# Altium schematic sheet microcontroller.SchDoc
size A3
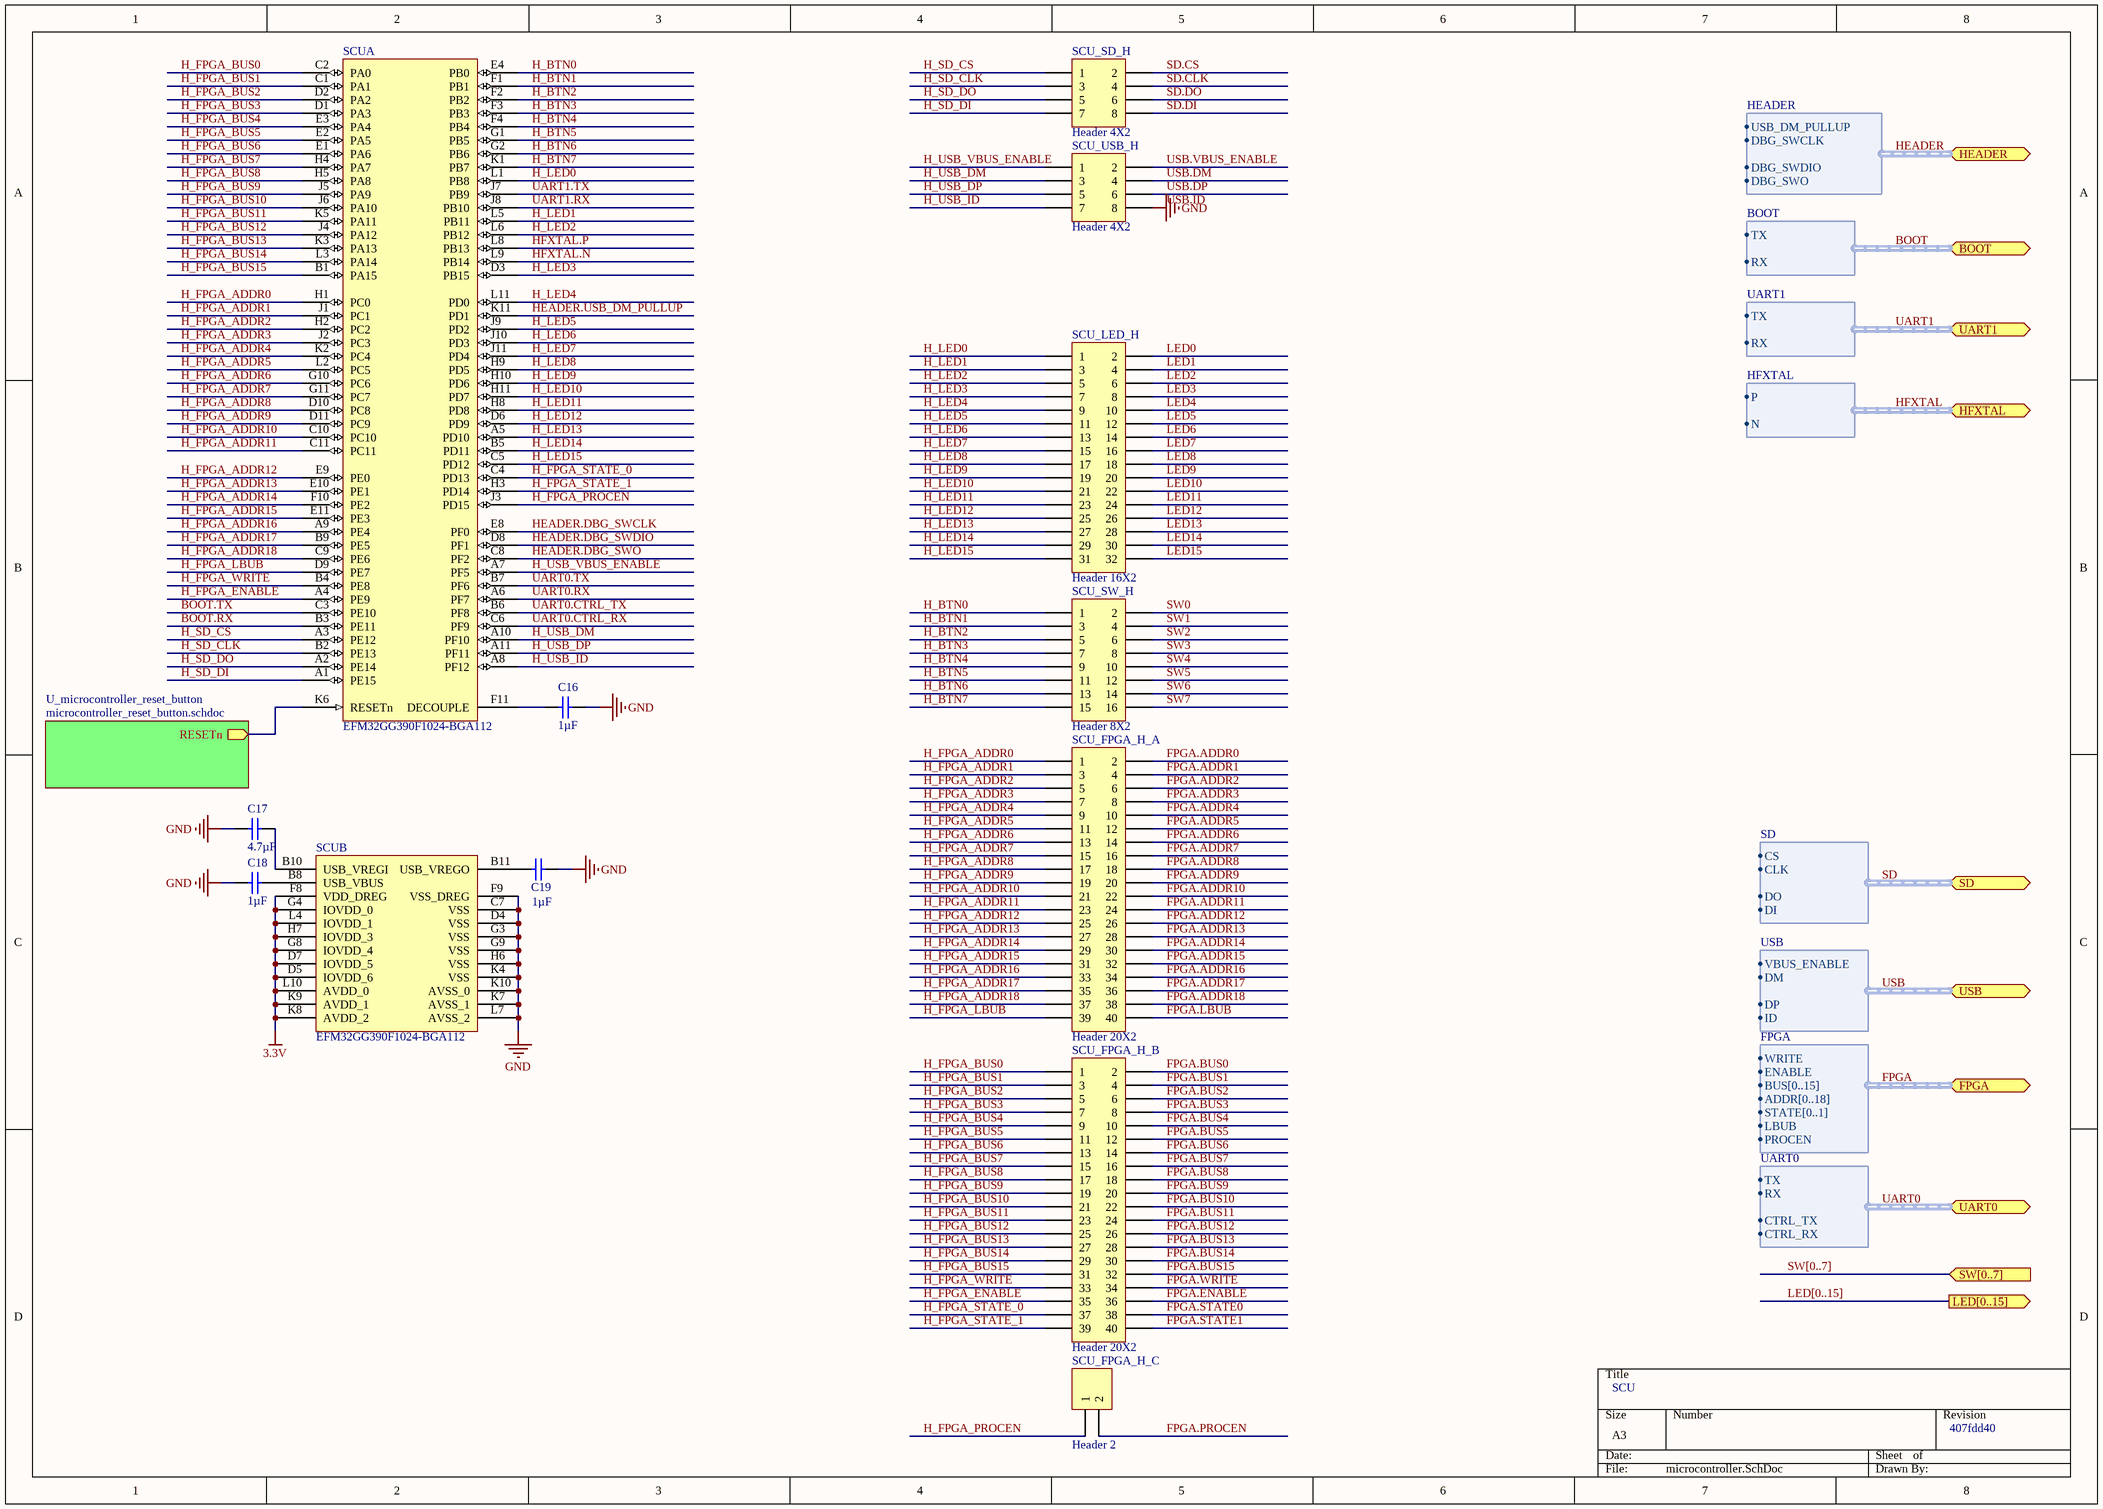
[diagram p0: microcontroller.SchDoc]

## Parts
C16  value 1µF  [CAPC1210(3225)100_L]  (hidden comment: CAP 1uF 100V 1210(3225))
C17  value 4.7µF  [CAPC1210(3225)100_L]  (hidden comment: CAP 4.7uF 100V 1210(3225))
C18  value 1µF  [CAPC1210(3225)100_L]  (hidden comment: CAP 1uF 100V 1210(3225))
C19  value 1µF  [CAPC1210(3225)100_L]  (hidden comment: CAP 1uF 100V 1210(3225))
SCU  EFM32GG390F1024-BGA112  [ENMR-BGA112]  (parts A,B of 2)
SCU_FPGA_H_A  Header 20X2  [HDR2X20]
SCU_FPGA_H_B  Header 20X2  [HDR2X20]
SCU_FPGA_H_C  Header 2  [HDR1X2]
SCU_LED_H  Header 16X2  [HDR2X16]
SCU_SD_H  Header 4X2  [HDR2X4]
SCU_SW_H  Header 8X2  [HDR2X8]
SCU_USB_H  Header 4X2  [HDR2X4]

## Sub-sheets
U_microcontroller_reset_button = microcontroller_reset_button.schdoc: RESETn (out)

## Ports
BOOT (harness BOOT), FPGA (harness FPGA), HEADER (harness HEADER), HFXTAL (harness HFXTAL), LED[0..15] (out), SD (harness SD), SW[0..7] (in), UART0 (harness UART0), UART1 (harness UART1), USB (harness USB)

## Harnesses
UART0: TX, RX, CTRL_TX, CTRL_RX
FPGA: WRITE, ENABLE, ADDR[0..18], STATE[0..1], BUS[0..15], LBUB, PROCEN
HFXTAL: P, N
UART1: TX, RX
USB: VBUS_ENABLE, DM, DP, ID
BOOT: TX, RX
SD: CS, CLK, DO, DI
HEADER: USB_DM_PULLUP, DBG_SWCLK, DBG_SWDIO, DBG_SWO

## Nets
3.3V: SCU.D5(IOVDD_6) SCU.D7(IOVDD_5) SCU.F8(VDD_DREG) SCU.G4(IOVDD_0) SCU.G8(IOVDD_4) SCU.H7(IOVDD_3) SCU.K8(AVDD_2) SCU.K9(AVDD_1) SCU.L4(IOVDD_1) SCU.L10(AVDD_0)
GND: C16.2 C17.2 C18.2 C19.2 SCU.C7(VSS) SCU.D4(VSS) SCU.F9(VSS_DREG) SCU.G3(VSS) SCU.G9(VSS) SCU.H6(VSS) SCU.K4(VSS) SCU.K7(AVSS_1) SCU.K10(AVSS_0) SCU.L7(AVSS_2) SCU_USB_H.8
BOOT.RX: SCU.B3(PE11)
BOOT.TX: SCU.C3(PE10)
FPGA.ADDR0: SCU_FPGA_H_A.2
FPGA.ADDR1: SCU_FPGA_H_A.4
FPGA.ADDR2: SCU_FPGA_H_A.6
FPGA.ADDR3: SCU_FPGA_H_A.8
FPGA.ADDR4: SCU_FPGA_H_A.10
FPGA.ADDR5: SCU_FPGA_H_A.12
FPGA.ADDR6: SCU_FPGA_H_A.14
FPGA.ADDR7: SCU_FPGA_H_A.16
FPGA.ADDR8: SCU_FPGA_H_A.18
FPGA.ADDR9: SCU_FPGA_H_A.20
FPGA.ADDR10: SCU_FPGA_H_A.22
FPGA.ADDR11: SCU_FPGA_H_A.24
FPGA.ADDR12: SCU_FPGA_H_A.26
FPGA.ADDR13: SCU_FPGA_H_A.28
FPGA.ADDR14: SCU_FPGA_H_A.30
FPGA.ADDR15: SCU_FPGA_H_A.32
FPGA.ADDR16: SCU_FPGA_H_A.34
FPGA.ADDR17: SCU_FPGA_H_A.36
FPGA.ADDR18: SCU_FPGA_H_A.38
FPGA.BUS0: SCU_FPGA_H_B.2
FPGA.BUS1: SCU_FPGA_H_B.4
FPGA.BUS2: SCU_FPGA_H_B.6
FPGA.BUS3: SCU_FPGA_H_B.8
FPGA.BUS4: SCU_FPGA_H_B.10
FPGA.BUS5: SCU_FPGA_H_B.12
FPGA.BUS6: SCU_FPGA_H_B.14
FPGA.BUS7: SCU_FPGA_H_B.16
FPGA.BUS8: SCU_FPGA_H_B.18
FPGA.BUS9: SCU_FPGA_H_B.20
FPGA.BUS10: SCU_FPGA_H_B.22
FPGA.BUS11: SCU_FPGA_H_B.24
FPGA.BUS12: SCU_FPGA_H_B.26
FPGA.BUS13: SCU_FPGA_H_B.28
FPGA.BUS14: SCU_FPGA_H_B.30
FPGA.BUS15: SCU_FPGA_H_B.32
FPGA.ENABLE: SCU_FPGA_H_B.36
FPGA.LBUB: SCU_FPGA_H_A.40
FPGA.PROCEN: SCU_FPGA_H_C.2
FPGA.STATE0: SCU_FPGA_H_B.38
FPGA.STATE1: SCU_FPGA_H_B.40
FPGA.WRITE: SCU_FPGA_H_B.34
H_BTN0: SCU.E4(PB0) SCU_SW_H.1
H_BTN1: SCU.F1(PB1) SCU_SW_H.3
H_BTN2: SCU.F2(PB2) SCU_SW_H.5
H_BTN3: SCU.F3(PB3) SCU_SW_H.7
H_BTN4: SCU.F4(PB4) SCU_SW_H.9
H_BTN5: SCU.G1(PB5) SCU_SW_H.11
H_BTN6: SCU.G2(PB6) SCU_SW_H.13
H_BTN7: SCU.K1(PB7) SCU_SW_H.15
H_FPGA_ADDR0: SCU.H1(PC0) SCU_FPGA_H_A.1
H_FPGA_ADDR1: SCU.J1(PC1) SCU_FPGA_H_A.3
H_FPGA_ADDR2: SCU.H2(PC2) SCU_FPGA_H_A.5
H_FPGA_ADDR3: SCU.J2(PC3) SCU_FPGA_H_A.7
H_FPGA_ADDR4: SCU.K2(PC4) SCU_FPGA_H_A.9
H_FPGA_ADDR5: SCU.L2(PC5) SCU_FPGA_H_A.11
H_FPGA_ADDR6: SCU.G10(PC6) SCU_FPGA_H_A.13
H_FPGA_ADDR7: SCU.G11(PC7) SCU_FPGA_H_A.15
H_FPGA_ADDR8: SCU.D10(PC8) SCU_FPGA_H_A.17
H_FPGA_ADDR9: SCU.D11(PC9) SCU_FPGA_H_A.19
H_FPGA_ADDR10: SCU.C10(PC10) SCU_FPGA_H_A.21
H_FPGA_ADDR11: SCU.C11(PC11) SCU_FPGA_H_A.23
H_FPGA_ADDR12: SCU.E9(PE0) SCU_FPGA_H_A.25
H_FPGA_ADDR13: SCU.E10(PE1) SCU_FPGA_H_A.27
H_FPGA_ADDR14: SCU.F10(PE2) SCU_FPGA_H_A.29
H_FPGA_ADDR15: SCU.E11(PE3) SCU_FPGA_H_A.31
H_FPGA_ADDR16: SCU.A9(PE4) SCU_FPGA_H_A.33
H_FPGA_ADDR17: SCU.B9(PE5) SCU_FPGA_H_A.35
H_FPGA_ADDR18: SCU.C9(PE6) SCU_FPGA_H_A.37
H_FPGA_BUS0: SCU.C2(PA0) SCU_FPGA_H_B.1
H_FPGA_BUS1: SCU.C1(PA1) SCU_FPGA_H_B.3
H_FPGA_BUS2: SCU.D2(PA2) SCU_FPGA_H_B.5
H_FPGA_BUS3: SCU.D1(PA3) SCU_FPGA_H_B.7
H_FPGA_BUS4: SCU.E3(PA4) SCU_FPGA_H_B.9
H_FPGA_BUS5: SCU.E2(PA5) SCU_FPGA_H_B.11
H_FPGA_BUS6: SCU.E1(PA6) SCU_FPGA_H_B.13
H_FPGA_BUS7: SCU.H4(PA7) SCU_FPGA_H_B.15
H_FPGA_BUS8: SCU.H5(PA8) SCU_FPGA_H_B.17
H_FPGA_BUS9: SCU.J5(PA9) SCU_FPGA_H_B.19
H_FPGA_BUS10: SCU.J6(PA10) SCU_FPGA_H_B.21
H_FPGA_BUS11: SCU.K5(PA11) SCU_FPGA_H_B.23
H_FPGA_BUS12: SCU.J4(PA12) SCU_FPGA_H_B.25
H_FPGA_BUS13: SCU.K3(PA13) SCU_FPGA_H_B.27
H_FPGA_BUS14: SCU.L3(PA14) SCU_FPGA_H_B.29
H_FPGA_BUS15: SCU.B1(PA15) SCU_FPGA_H_B.31
H_FPGA_ENABLE: SCU.A4(PE9) SCU_FPGA_H_B.35
H_FPGA_LBUB: SCU.D9(PE7) SCU_FPGA_H_A.39
H_FPGA_PROCEN: SCU.J3(PD15) SCU_FPGA_H_C.1
H_FPGA_STATE_0: SCU.C4(PD13) SCU_FPGA_H_B.37
H_FPGA_STATE_1: SCU.H3(PD14) SCU_FPGA_H_B.39
H_FPGA_WRITE: SCU.B4(PE8) SCU_FPGA_H_B.33
H_LED0: SCU.L1(PB8) SCU_LED_H.1
H_LED1: SCU.L5(PB11) SCU_LED_H.3
H_LED2: SCU.L6(PB12) SCU_LED_H.5
H_LED3: SCU.D3(PB15) SCU_LED_H.7
H_LED4: SCU.L11(PD0) SCU_LED_H.9
H_LED5: SCU.J9(PD2) SCU_LED_H.11
H_LED6: SCU.J10(PD3) SCU_LED_H.13
H_LED7: SCU.J11(PD4) SCU_LED_H.15
H_LED8: SCU.H9(PD5) SCU_LED_H.17
H_LED9: SCU.H10(PD6) SCU_LED_H.19
H_LED10: SCU.H11(PD7) SCU_LED_H.21
H_LED11: SCU.H8(PD8) SCU_LED_H.23
H_LED12: SCU.D6(PD9) SCU_LED_H.25
H_LED13: SCU.A5(PD10) SCU_LED_H.27
H_LED14: SCU.B5(PD11) SCU_LED_H.29
H_LED15: SCU.C5(PD12) SCU_LED_H.31
H_SD_CLK: SCU.B2(PE13) SCU_SD_H.3
H_SD_CS: SCU.A3(PE12) SCU_SD_H.1
H_SD_DI: SCU.A1(PE15) SCU_SD_H.7
H_SD_DO: SCU.A2(PE14) SCU_SD_H.5
H_USB_DM: SCU.A10(PF10) SCU_USB_H.3
H_USB_DP: SCU.A11(PF11) SCU_USB_H.5
H_USB_ID: SCU.A8(PF12) SCU_USB_H.7
H_USB_VBUS_ENABLE: SCU.A7(PF5) SCU_USB_H.1
HEADER.DBG_SWCLK: SCU.E8(PF0)
HEADER.DBG_SWDIO: SCU.D8(PF1)
HEADER.DBG_SWO: SCU.C8(PF2)
HEADER.USB_DM_PULLUP: SCU.K11(PD1)
HFXTAL.N: SCU.L9(PB14)
HFXTAL.P: SCU.L8(PB13)
LED0: SCU_LED_H.2
LED1: SCU_LED_H.4
LED2: SCU_LED_H.6
LED3: SCU_LED_H.8
LED4: SCU_LED_H.10
LED5: SCU_LED_H.12
LED6: SCU_LED_H.14
LED7: SCU_LED_H.16
LED8: SCU_LED_H.18
LED9: SCU_LED_H.20
LED10: SCU_LED_H.22
LED11: SCU_LED_H.24
LED12: SCU_LED_H.26
LED13: SCU_LED_H.28
LED14: SCU_LED_H.30
LED15: SCU_LED_H.32
SD.CLK: SCU_SD_H.4
SD.CS: SCU_SD_H.2
SD.DI: SCU_SD_H.8
SD.DO: SCU_SD_H.6
SW0: SCU_SW_H.2
SW1: SCU_SW_H.4
SW2: SCU_SW_H.6
SW3: SCU_SW_H.8
SW4: SCU_SW_H.10
SW5: SCU_SW_H.12
SW6: SCU_SW_H.14
SW7: SCU_SW_H.16
UART0.CTRL_RX: SCU.C6(PF9)
UART0.CTRL_TX: SCU.B6(PF8)
UART0.RX: SCU.A6(PF7)
UART0.TX: SCU.B7(PF6)
UART1.RX: SCU.J8(PB10)
UART1.TX: SCU.J7(PB9)
USB.DM: SCU_USB_H.4
USB.DP: SCU_USB_H.6
USB.VBUS_ENABLE: SCU_USB_H.2
NetC16_1: C16.1 SCU.F11(DECOUPLE)
NetC17_1: C17.1 SCU.B10(USB_VREGI)
NetC18_1: C18.1 SCU.B8(USB_VBUS)
NetC19_1: C19.1 SCU.B11(USB_VREGO)
NetSCU_K6: SCU.K6(RESETn) ; sheet U_microcontroller_reset_button/RESETn

## Buses and harness runs
bus LED[0..15] = port LED[0..15]
bus SW[0..7] = port SW[0..7]
harness BOOT = port BOOT
harness FPGA = port FPGA
harness HEADER = port HEADER
harness HFXTAL = port HFXTAL
harness SD = port SD
harness UART0 = port UART0
harness UART1 = port UART1
harness USB = port USB

## Notes on the sheet
- SCU
- 407fdd40
- Labels drawn without touching a wire or pin: USB.ID

## Library data of the parts
C16 C18 C19 = CMP-1038-00005-1: CAP 1uF 100V ±0.25pF 1210 (3225 Metric) Thickness 1mm SMD; Case-Metric: 3225; Case-EIA: 1210; Max Thickness: 1 mm; Rated Voltage: 100 V; Technology: SMT; Tolerance: ±0.25pF
C17 = CMP-1038-00005-1: CAP 4.7uF 100V ±0.25pF 1210 (3225 Metric) Thickness 1mm SMD; Case-Metric: 3225; Case-EIA: 1210; Max Thickness: 1 mm; Rated Voltage: 100 V; Technology: SMT; Tolerance: ±0.25pF
SCU = CMP-0270-00014-1: EFM32 Giant Gecko, M3 ARM Cortex CPU, 1024 KB Flash, 128 KB RAM, 1.85 - 3.8 V Supply, 48 MHz Max Speed, -40 to 85 degC, 112-Pin BGA, RoHS Compliant; LESENSE: Y; Max Speed (MHz): 48; Flash (KB): 1024; GPIO: 87; OPAMPS: 3; RAM (KB): 128; PackageDescription: 112-Pin Ball Grid Array, Body 10 x 10 mm, Pitch 0.8 mm; PartNumber: EFM32GG390F1024-BGA112; USB: Y; PackageReference: BGA112; PackageVersion: Rev. 97SPP01315A_X03_06Jun11; ComponentLink3Description: Package Specification; ComponentLink2Description: Datasheet; ComponentLink1URL: http://www.energymicro.com/; Generic Part Number: EFM32GG390; ARM Cortex CPU: M3; Subcategory: EFM32 Giant Gecko; DatasheetVersion: Rev 1.00; ComponentLink2URL: http://cdn.energymicro.com/dl/devices/pdf/d0040_efm32gg390_datasheet.pdf; Mounting Technology: Surface Mount; ComponentLink3URL: http://cdn.energymicro.com/dl/devices/pdf/d0007_efm32g290_datasheet.pdf; ComponentLink1Description: Manufacturer URL; Supply Voltage (V): 1.85 - 3.8
SCU_FPGA_H_A SCU_FPGA_H_B = Header 20X2: Header, 20-Pin, Dual row; LatestRevisionDate: 17-Jul-2002; LatestRevisionNote: Re-released for DXP Platform.; Publisher: Altium Limited
SCU_FPGA_H_C = Header 2: Header, 2-Pin; LatestRevisionDate: 17-Jul-2002; LatestRevisionNote: Re-released for DXP Platform.; Publisher: Altium Limited
SCU_LED_H = Header 16X2: Header, 16-Pin, Dual row; LatestRevisionDate: 17-Jul-2002; LatestRevisionNote: Re-released for DXP Platform.; Publisher: Altium Limited
SCU_SD_H SCU_USB_H = Header 4X2: Header, 4-Pin, Dual row; LatestRevisionDate: 17-Jul-2002; LatestRevisionNote: Re-released for DXP Platform.; Publisher: Altium Limited
SCU_SW_H = Header 8X2: Header, 8-Pin, Dual row; LatestRevisionDate: 17-Jul-2002; LatestRevisionNote: Re-released for DXP Platform.; Publisher: Altium Limited